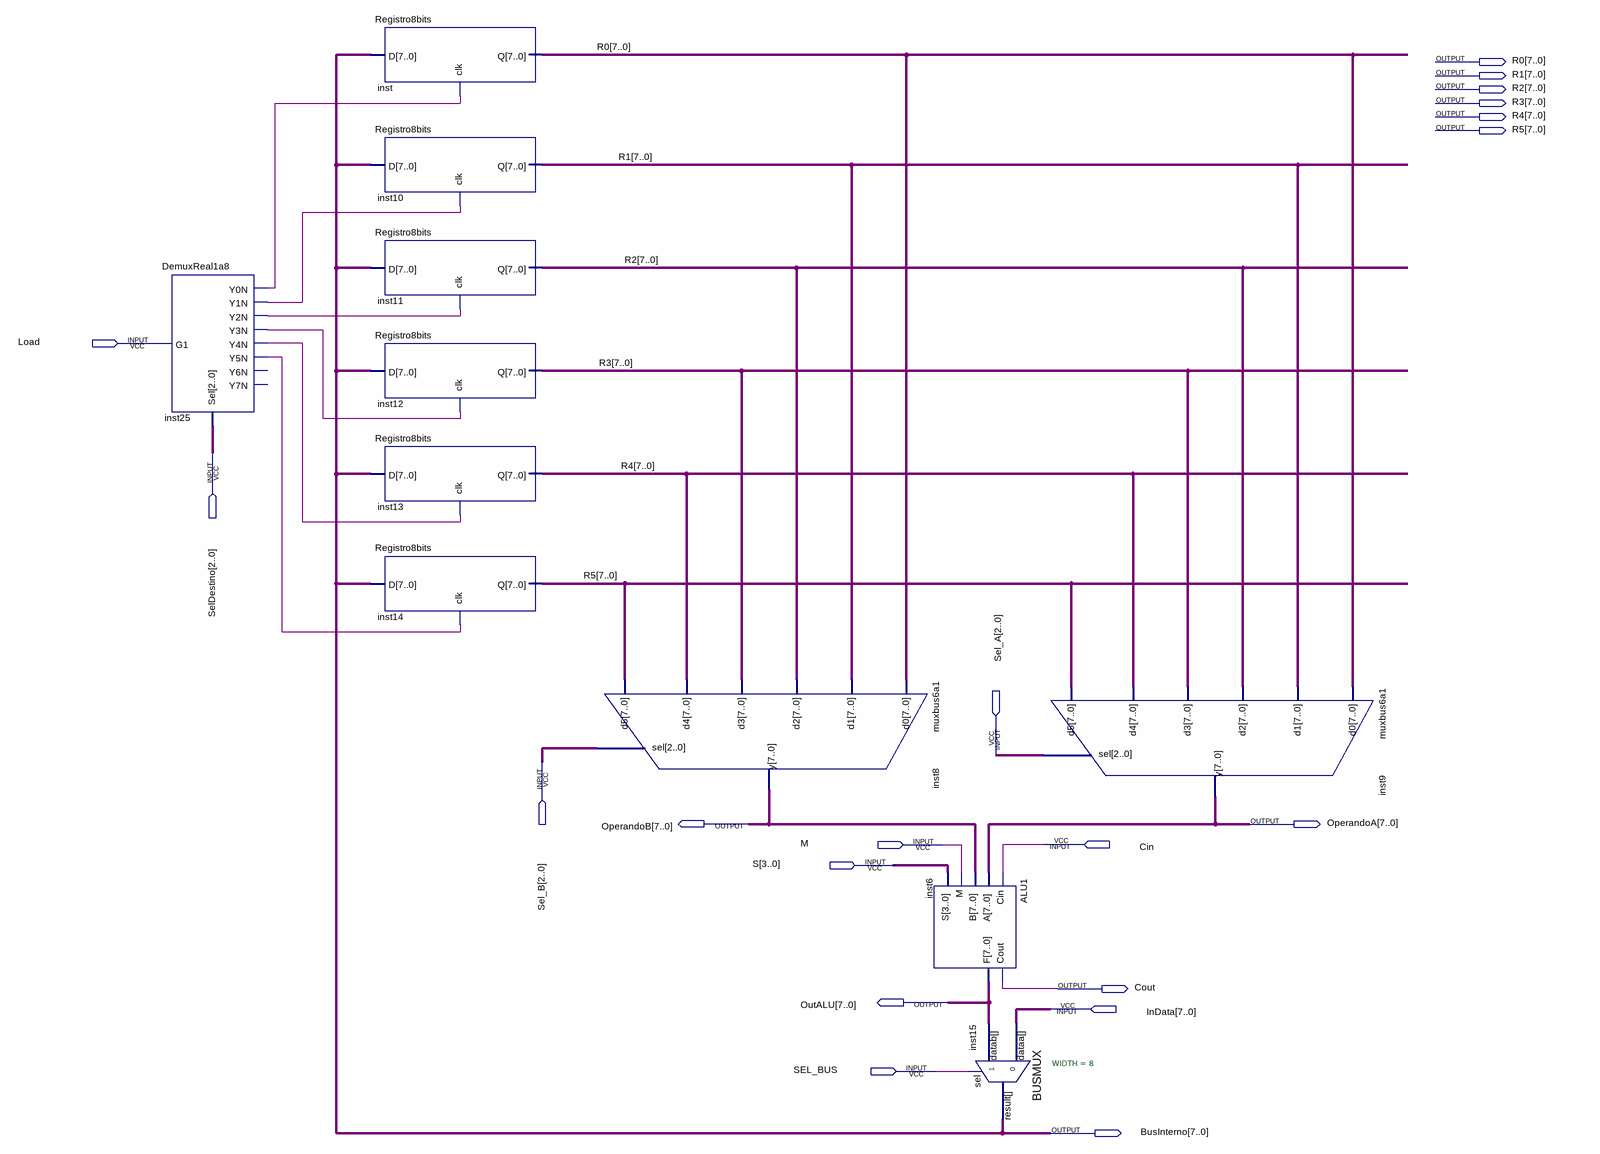
[diagram p0: schematic sheet]
// Quartus schematic CPU8bitsOrigen.bdf as structural Verilog: 11 symbols, 20 pins
module CPU8bitsOrigen (
  input  Load,
  input  [2:0] SelDestino,
  input  [2:0] Sel_A,
  input  [2:0] Sel_B,
  input  M,
  input  Cin,
  input  [3:0] S,
  input  [7:0] InData,
  input  SEL_BUS,
  output [7:0] R0,
  output [7:0] R1,
  output [7:0] R2,
  output [7:0] R3,
  output [7:0] R4,
  output [7:0] R5,
  output [7:0] OperandoB,
  output [7:0] OperandoA,
  output Cout,
  output [7:0] OutALU,
  output [7:0] BusInterno
);

  wire inst25_y0n, inst25_y1n, inst25_y2n, inst25_y3n, inst25_y4n, inst25_y5n;

  DemuxReal1a8 inst25 (
    .G1(Load), .Sel(SelDestino), .Y0N(inst25_y0n), .Y1N(inst25_y1n), .Y2N(inst25_y2n), .Y3N(inst25_y3n),
    .Y4N(inst25_y4n), .Y5N(inst25_y5n));  // open: Y6N, Y7N
  Registro8bits inst (.D(BusInterno), .clk(inst25_y0n), .Q(R0));
  Registro8bits inst10 (.D(BusInterno), .clk(inst25_y1n), .Q(R1));
  Registro8bits inst11 (.D(BusInterno), .clk(inst25_y2n), .Q(R2));
  Registro8bits inst12 (.D(BusInterno), .clk(inst25_y3n), .Q(R3));
  Registro8bits inst13 (.D(BusInterno), .clk(inst25_y4n), .Q(R4));
  Registro8bits inst14 (.D(BusInterno), .clk(inst25_y5n), .Q(R5));
  muxbus6a1 inst8 (.sel(Sel_B), .d0(R0), .d1(R1), .d2(R2), .d3(R3), .d4(R4), .d5(R5), .y(OperandoB));
  ALU1 inst6 (.Cin(Cin), .A(OperandoA), .B(OperandoB), .M(M), .S(S), .Cout(Cout), .F(OutALU));
  BUSMUX #(.WIDTH(8)) inst15 (.datab(OutALU), .sel(SEL_BUS), .dataa(InData), .result(BusInterno));
  muxbus6a1 inst9 (.sel(Sel_A), .d0(R0), .d1(R1), .d2(R2), .d3(R3), .d4(R4), .d5(R5), .y(OperandoA));
endmodule
